# EAGLE design IMU_final (EAGLE 9.6.2)
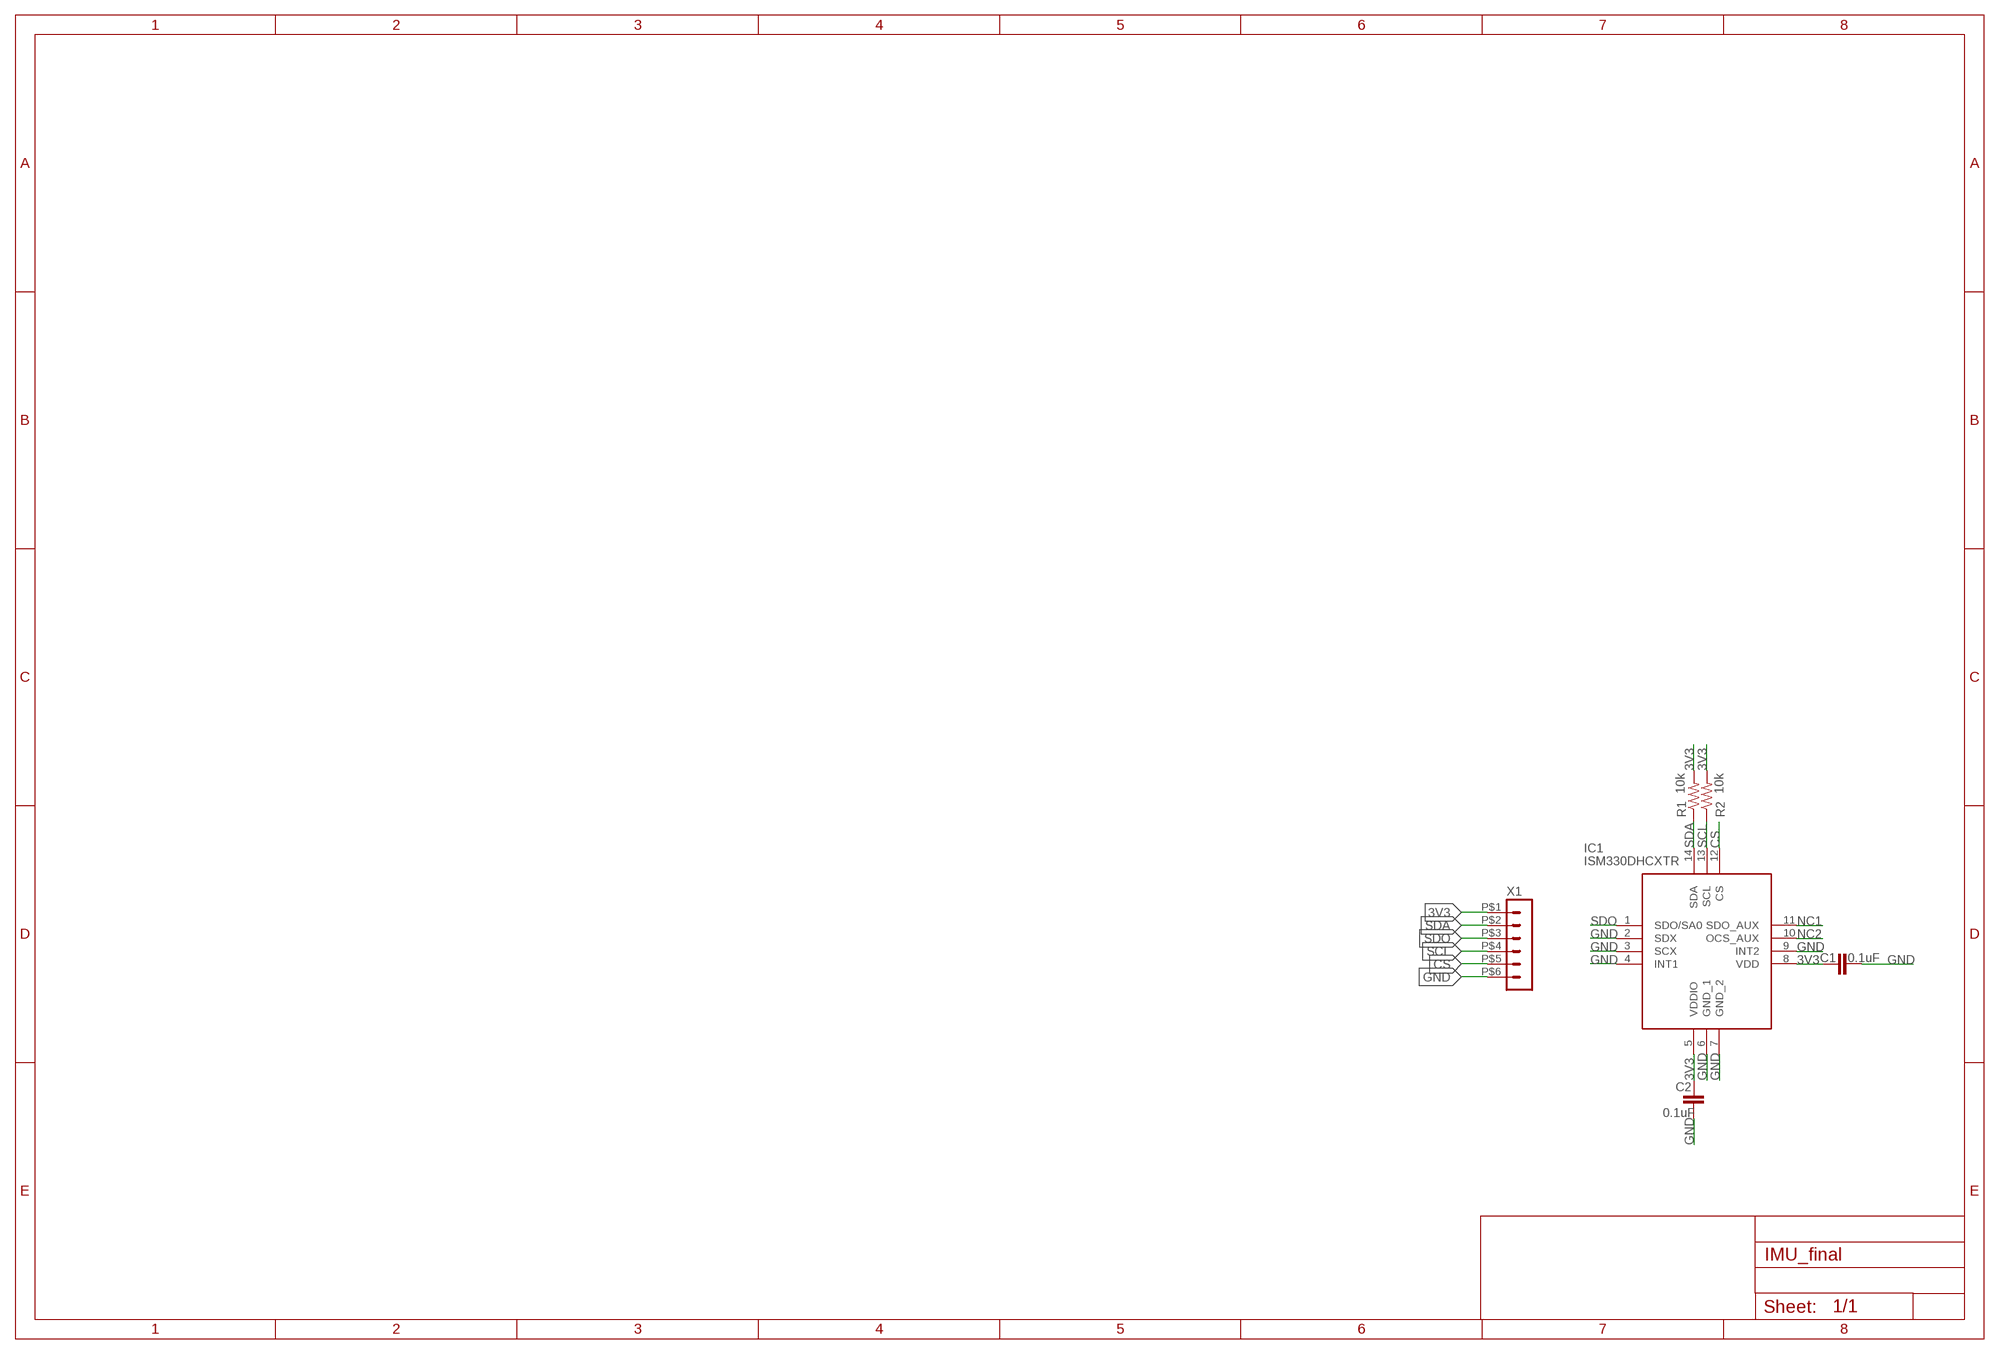
[diagram p0: schematic, sheet 1]

## Parts
C1  0.1uF  0.1UF-0603-25V-(+80/-20%)  [0603]
C2  0.1uF  0.1UF-0603-25V-(+80/-20%)  [0603]
IC1  ISM330DHCXTR  [LGA-14(2.5X3X0.86)]
R1  10k  10KOHM-0603-1/10W-1%  [0603]
R2  10k  10KOHM-0603-1/10W-1%  [0603]
X1  HEADER_POS6_43045-0600  [43045-0600]

## Nets
3V3: C1.1 C2.1 IC1.5(VDDIO) IC1.8(VDD) R1.2 R2.2 X1.P$1
CS: IC1.12(CS) X1.P$5
GND: C1.2 C2.2 IC1.2(SDX) IC1.3(SCX) IC1.4(INT1) IC1.6(GND_1) IC1.7(GND_2) IC1.9(INT2) X1.P$6
NC1: IC1.11(SDO_AUX)
NC2: IC1.10(OCS_AUX)
SCL: IC1.13(SCL) R2.1 X1.P$4
SDA: IC1.14(SDA) R1.1 X1.P$2
SDO: IC1.1(SDO/SA0) X1.P$3

## Library data of the parts
C1 C2 = SparkFun-Capacitors:0.1UF: 0.1µF ceramic capacitors A capacitor is a passive two-terminal electrical component used to store electrical energy temporarily in an electric field.; PROD_ID: CAP-00810
IC1 = ISM330DHCXTR:ISM330DHCXTR: IMUs - Inertial Measurement Units VFLGA2.5X3X.86 14L P.5 L.475X.25 Source: Datasheet <https://www.st.com/resource/en/datasheet/ism330dhcx.pdf>; ARROW_PART_NUMBER: ISM330DHCXTR; ARROW_PRICE-STOCK: https://www.arrow.com/en/products/ism330dhcxtr/stmicroelectronics; DESCRIPTION: IMUs - Inertial Measurement Units VFLGA2.5X3X.86 14L P.5 L.475X.25; HEIGHT: mm; MANUFACTURER_NAME: STMicroelectronics; MANUFACTURER_PART_NUMBER: ISM330DHCXTR; MOUSER_PART_NUMBER: 511-ISM330DHCXTR; MOUSER_PRICE-STOCK: https://www.mouser.co.uk/ProductDetail/STMicroelectronics/ISM330DHCXTR?qs=%252B6g0mu59x7Jv2Xps2dM6Xw%3D%3D
R1 R2 = SparkFun-Resistors:10KOHM: 10kΩ resistor A resistor is a passive two-terminal electrical component that implements electrical resistance as a circuit element. Resistors act to reduce current flow, and, at the same time, act to lower voltage levels within circuits. - Wikipedia; PROD_ID: RES-00824
X1 = GTOR - Microfit Connector:HEADER_POS6_?: Molex - Micro-Fit 3.0 Series connector, 3.00mm (0.118") pitch header, 6 positions.

## Board
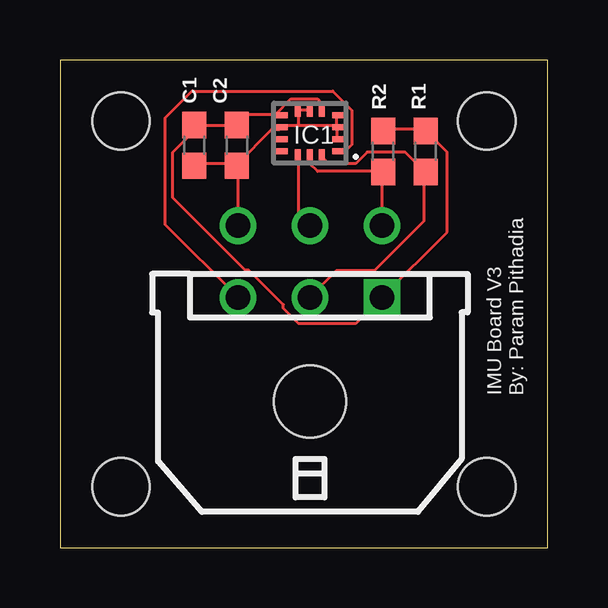
[diagram p1: board, top side]

Size 20.32 x 20.32 mm. Coordinates in mm from the lower left corner, seen from the top.
Outline: 20.32,20.32 0,20.32 0,0 20.32,0 20.32,20.32
Copper layers (1*16): Top 0.035mm / dielectric 1.6mm / Bottom 0.035mm
Design rules "designrulecheck_jlcpcb_2layers": minimum track width 5mil, minimum drill 0.3mm, track to track 5mil, track to pad 0.2mm, pad to pad 5mil, via to via 10mil, smd to smd 5mil, copper to edge 0.2mm, drill to drill 0.5mm, minimum pad ring 10mil, minimum via ring 0.3mm, stop-mask expansion 4mil, vias tented up to drill 0mil, thermal gap 10mil
Holes 2.39 mm at 2.54,17.78 2.54,2.54 17.78,17.78 17.78,2.54

### Footprints (pad centres in the part's own frame; a part is rotated, then mirrored left to right if it is on the bottom)
0603 = smd 1.1 x 1: 1 -0.85,0; 2 0.85,0
LGA-14(2.5X3X0.86) = smd 0.475 x 0.25: 1 -1.163,0.75; 2 -1.163,0.25; 3 -1.163,-0.25; 4 -1.163,-0.75; 8 1.163,-0.75; 9 1.163,-0.25; 10 1.163,0.25; 11 1.163,0.75 | smd 0.25 x 0.475: 5 -0.5,-0.912; 6 0,-0.912; 7 0.5,-0.912; 12 0.5,0.912; 13 0,0.912; 14 -0.5,0.912
43045-0600 = drill 1.02 square: P$1 3,4.32 | drill 1.02: P$2 0,4.32; P$3 -3,4.32; P$4 3,7.32; P$5 0,7.32; P$6 -3,7.32 | hole 3: 0,0

### Placement (x,y rotation side)
C1  5.59,16.76 270 top
C2  7.37,16.76 270 top
IC1  10.41,17.27 180 top
R1  15.24,16.51 90 top
R2  13.46,16.51 90 top
X1  10.41,6.1 0 top

### Tracks (layer width: path | path; a pad name or v marks a point on that pad's centre or on a via)
3V3
  Top 0.127: 8.98,18.07 7.71,18.07 7.4,17.75 C2.1 7.24,17.59 5.65,17.59 C1.1 5.49,17.59 5.49,17.27 4.7,16.48 4.7,14.57 7.71,11.56 7.87,11.56 9.3,10.13 9.3,9.97 9.94,9.34 12.32,9.34 13.27,10.29 X1.P$1 13.43,10.45 16.13,13.14 16.13,16.48 15.34,17.27 R1.2 15.18,17.43 13.59,17.43 R2.2 | 8.98,18.07 9.14,18.07 IC1.8 | 8.98,18.07 9.62,18.7 10.73,18.7 10.89,18.54 10.89,18.22 IC1.5
CS
  Top 0.127: IC1.12 9.94,16.32 9.94,13.94 10.41,13.46 X1.P$5
GND
  Top 0.127: IC1.6 10.41,18.22 9.94,18.22 IC1.7 9.94,18.07 9.94,17.59 | 11.53,17.59 9.94,17.59 | 9.94,17.59 9.3,17.59 IC1.9 9.14,17.43 8.83,17.43 7.4,16 C2.2 | IC1.2 11.53,17.11 11.53,17.43 IC1.3 11.53,17.59 | 11.53,17.59 11.53,17.91 IC1.4 | C1.2 5.65,16 7.24,16 C2.2 | X1.P$6 7.4,13.46 7.4,15.84 C2.2
SCL
  Top 0.127: IC1.13 10.41,16 10.73,15.68 13.43,15.68 R2.1 13.43,15.53 13.43,13.46 X1.P$4
SDA
  Top 0.127: IC1.14 10.89,16.32 11.21,16 12.32,16 12.79,16.48 14.38,16.48 15.18,15.68 R1.1 15.18,15.53 15.18,13.62 13.11,11.56 11.53,11.56 10.41,10.45 X1.P$2
SDO
  Top 0.127: IC1.1 11.68,16.48 11.84,16.48 12.16,16.8 12.16,18.22 11.37,19.02 5.49,19.02 4.38,17.91 4.38,13.46 7.4,10.45 X1.P$3

### Text on the board
tNames: IMU Board V3 / By: Param Pithadia